# EAGLE design ict_v361 (EAGLE 9.6.2)
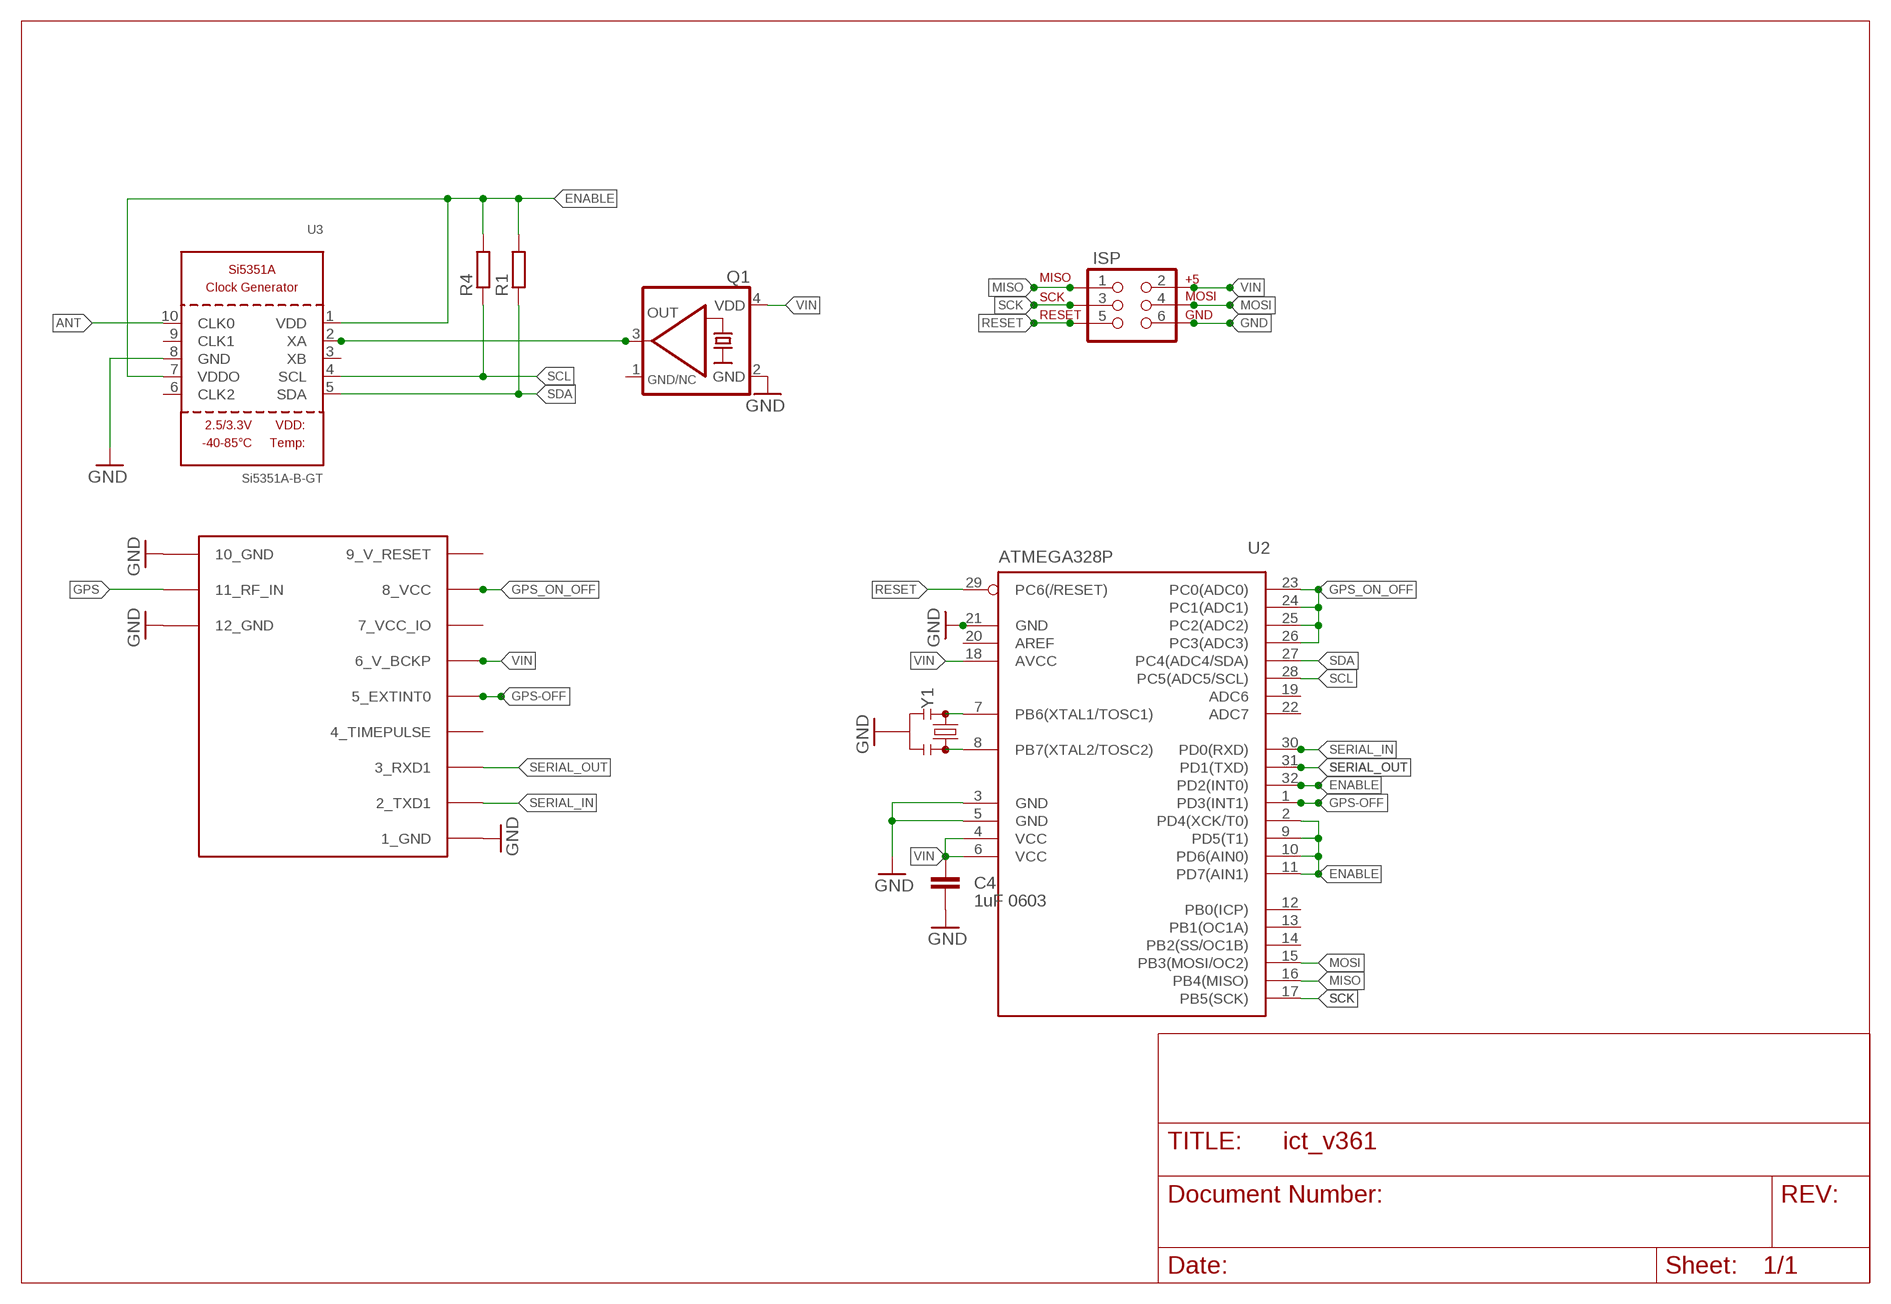
[diagram p0: schematic, sheet 1]

## Parts
C4  1uF 0603  C-EUC0603K  [C0603K]
ISP  AVR_SPI_PRG_6PTH  [2X3]
Q1  KXO-TCXO-CMOS-84  [3.2X2.5_KXO-84-TCXO]
R1  R-EU_R0603  [R0603]
R4  R-EU_R0603  [R0603]
U2  ATMEGA328P  MEGA8-AI  [TQFP32-08]
U3  Si5351A-B-GT  SI5351A  [MSOP10]
U$2  UBLOX_MAX  [UBLOX_MAX]
Y1  RESONATORSMD-4.5X2.0  [RESONATOR-SMD-4.5X2.0]

## Nets
ANT: U3.10(CLK0)
ENABLE: R1.2 R4.2 U2.2(PD4(XCK/T0)) U2.9(PD5(T1)) U2.10(PD6(AIN0)) U2.11(PD7(AIN1)) U2.32(PD2(INT0)) U3.1(VDD) U3.7(VDDO)
GND: C4.2 ISP.6 Q1.2(GND) U2.3(GND) U2.5(GND) U2.21(GND) U3.8(GND) U$2.1_GND U$2.10_GND U$2.12_GND Y1.2
GPS: U$2.11_RF_IN
GPS-OFF: U2.1(PD3(INT1)) U$2.5_EXTINT0
GPS_ON_OFF: U2.23(PC0(ADC0)) U2.24(PC1(ADC1)) U2.25(PC2(ADC2)) U2.26(PC3(ADC3)) U$2.8_VCC
MISO: ISP.1 U2.16(PB4(MISO))
MOSI: ISP.4 U2.15(PB3(MOSI/OC2))
N$1: U2.8(PB7(XTAL2/TOSC2)) Y1.3
N$2: U2.7(PB6(XTAL1/TOSC1)) Y1.1
N$19: Q1.3(OUT) U3.2(XA)
RESET: ISP.5 U2.29(PC6(/RESET))
SCK: ISP.3 U2.17(PB5(SCK))
SCL: R4.1 U2.28(PC5(ADC5/SCL)) U3.4(SCL)
SDA: R1.1 U2.27(PC4(ADC4/SDA)) U3.5(SDA)
SERIAL_IN: U2.30(PD0(RXD)) U$2.2_TXD1
SERIAL_OUT: U2.31(PD1(TXD)) U$2.3_RXD1
VIN: C4.1 ISP.2 Q1.4(VDD) U2.4(VCC) U2.6(VCC) U2.18(AVCC) U$2.6_V_BCKP
Unconnected: U2.12(PB0(ICP)) U2.13(PB1(OC1A)) U2.14(PB2(SS/OC1B)) U2.19(ADC6) U2.20(AREF) U2.22(ADC7) U3.3(XB) U3.6(CLK2) U3.9(CLK1) U$2.4_TIMEPULSE

## Power pins joined to a net without a drawn wire
7_VCC_IO: U$2.7_VCC_IO
9_V_RESET: U$2.9_V_RESET
GND/NC: Q1.1(GND/NC)

## Library data of the parts
C4 = rcl:C-EU: CAPACITOR, European symbol; SPICEPREFIX: C
ISP = SparkFun:AVR_SPI_PRG_6: AVR ISP 6 Pin This is the reduced ISP connector for AVR programming. Common on Arduino. This footprint will take up less PCB space and can be used with a 10-pin to 6-pin adapter such as SKU: BOB-08508
Q1 = crystal-geyer_V1_0:KXO-TCXO-CMOS: TCXO : CMOS - Serie Model Size l/w/h [mm] Frequency Range Frequency Stability Temp. Range [°C] Output AECQ 200 availabel Datasheet KXO-86 KXO-84 KXO-83 KXO-82 2.5/2.0/0.7 3.2/2.5/1.0 5.0/3.2/1.5 7.0/5.0/2.4 13,0 ~ 40,0 MHz 10,0 ~ 40,0 MHz 10,0 ~ 40,0 MHz 10,0 ~ 30,0 MHz ±1,0 … ±2,5ppm ±1,0 … ±2,5ppm ±1,0 … ±3,0ppm ±1,0 … ±3,0ppm (*) -30°C …+75°C (*) -40°C …+85°C (*) -40°C …+85°C (*) -30°C …+80°C CMOS CMOS CMOS CMOS - - - - KXO-86.pdf <http://www.geyer-electronic.de/uploads/tx_userartikelfrequenz/GEYER-KXO-86-TCXO-HCMOS.pdf> KXO-84.pdf <http://www.geyer-electronic.de/uploads/tx_userartikelfrequenz/GEYER-KXO-84-TCXO-HCMOS.pdf> KXO-83.pdf <http://www.geyer-electronic.de/uploads/tx_userartikelfrequenz/GEYER-KXO-83-TCXO-HCMOS.pdf> KXO-82.pdf <http://www.geyer-electronic.de/uploads/tx_userartikelfrequenz/GEYER-KXO-82-TCXO-HCMOS.pdf> <http://www.geyer-electronic.de/fileadmin/template/img/logo-geyer-electronic.png> Details see: http://www.geyer-electronic.de/Frequenz-Produkte.9.0.html Created 2016-06-07, Hans Locher 2016 (C) Geyer Quartz Technology KXO86,KXO84,KXO83,KXO82;2550;3225;5032;7050;2,5x2,0;3,2x2,5;2.5x2.0;3.2x2.5,5,0x3,2;7,0x5,0,5.0x3.2,7.0x5.0
R1 R4 = resistor:R-EU_: RESISTOR, European symbol
U2 = atmel:MEGA8: MICROCONTROLLER 8 Kbytes FLASH, 1 kbytes SRAM, 512 bytes EEPROM, USART, 6-channel 10 bit ADC, 2-channel 8 bit ADC Pin compatible with Atmega48, ATMega88, ATMega168 Source: avr.lbr; MPN: ATMEGA8-16AU; OC_FARNELL: 9171371; OC_NEWARK: 73M8863
U3 = microbuilder:SI5351A: Si5351A 8kHz-160MHz I2C Clock Generator VDD: 2.5V or 3.3V Input Range: 25MHz or 27MHz XTAL User selectable internal input load capacitors: 6, 8 or 10 pF Output Impedance: 85 Ohm Output Load Capacitance: 5-15pF Operating Temperature: -40°C - 85°C Operating Current (3 outputs): 35mA Output buffer voltage (VDDO): 1.8, 2.5 or 3.3V Note: If VDDO is not used it should be connected to VDD. Unused clock out pins should be left floating.
U$2 = Max gps:UBLOX_MAX: UBLOX MAX
Y1 = SparkFun-Clocks:RESONATOR: Resonators (Generic) Ceramic resonators are clock-generating components, often used to control timing in microcontrollers. They usually have 3 pins: two pins for oscillation, and one pin for ground. Compared to crystals, resonators have worse tolerance, but are usually much cheaper. Plus, they have built-in load capacitors! These devices are used on boards like the Arduino Pro 8MHz <https://www.sparkfun.com/products/11114> and Arduino Pro 16MHz <https://www.sparkfun.com/products/11113>.

## Net classes
0 default: width 0.203 mm
1 vcc: width 0.152 mm, clearance 0.152 mm

## Board
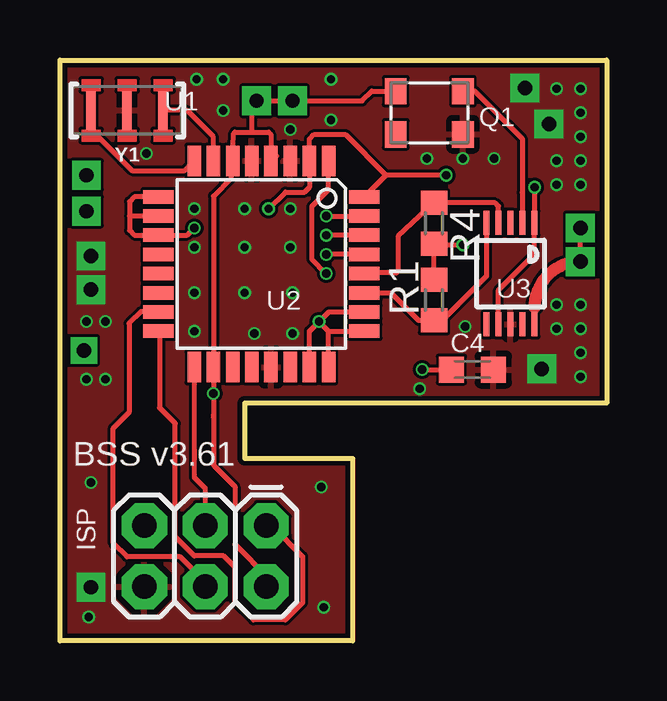
[diagram p1: board, top side]
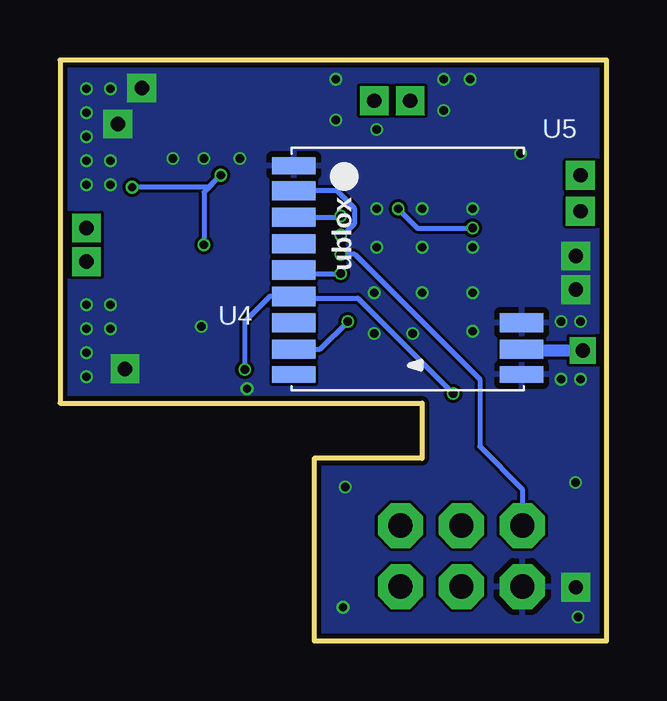
[diagram p2: board, bottom side, seen from below]

Size 22.8 x 24.2 mm. Coordinates in mm from the lower left corner, seen from the top.
Outline: 0,24.2 22.8,24.2 22.8,9.9 7.7,9.9 7.7,7.6 12.2,7.6 12.2,0 0,0 0,24.2
Copper layers (1*16): Top 0.035559375mm / dielectric 1.6mm / Bottom 0.035559375mm
Design rules "jlcpcb2layer *": minimum track width 5mil, minimum drill 12mil, track to track 5mil, track to pad 5mil, pad to pad 5mil, via to via 5mil, smd to smd 5mil, copper to edge 8mil, drill to drill 6mil, minimum pad ring 5mil, minimum via ring 3mil, stop-mask expansion 2.5mil, vias tented up to drill 14mil, thermal gap 10mil

### Footprints (pad centres in the part's own frame; a part is rotated, then mirrored left to right if it is on the bottom)
C0603K = smd 1.05 x 1.08: 1 -0.875,0; 2 0.875,0
2X3 = drill 1.016 pad 1.88 octagon: 1 0,0; 2 0,2.54; 3 2.54,0; 4 2.54,2.54; 5 5.08,0; 6 5.08,2.54
3.2X2.5_KXO-84-TCXO = smd 0.9 x 1.1: 1 -1.4,-0.9; 2 1.4,-0.9; 3 1.4,0.9; 4 -1.4,0.9
R0603 = smd 1 x 1.1: 1 -0.85,0; 2 0.85,0
TQFP32-08 = smd 1.27 x 0.559: 1 -4.293,2.8; 2 -4.293,2; 3 -4.293,1.2; 4 -4.293,0.4; 5 -4.293,-0.4; 6 -4.293,-1.2; 7 -4.293,-2; 8 -4.293,-2.8; 17 4.293,-2.8; 18 4.293,-2; 19 4.293,-1.2; 20 4.293,-0.4; 21 4.293,0.4; 22 4.293,1.2; 23 4.293,2; 24 4.293,2.8 | smd 0.559 x 1.27: 9 -2.8,-4.293; 10 -2,-4.293; 11 -1.2,-4.293; 12 -0.4,-4.293; 13 0.4,-4.293; 14 1.2,-4.293; 15 2,-4.293; 16 2.8,-4.293; 25 2.8,4.293; 26 2,4.293; 27 1.2,4.293; 28 0.4,4.293; 29 -0.4,4.293; 30 -1.2,4.293; 31 -2,4.293; 32 -2.8,4.293
MSOP10 = smd 0.25 x 1: 1 -1,-2.113; 2 -0.5,-2.113; 3 0,-2.113; 4 0.5,-2.113; 5 1,-2.113; 6 1,2.113; 7 0.5,2.113; 8 0,2.113; 9 -0.5,2.113; 10 -1,2.113
UBLOX_MAX = smd 1.8 x 0.7: 1_GND 4.95,-4.4; 9_V_RESET 4.95,4.3; 10_GND -4.55,4.3 | smd 1.8 x 0.8: 2_TXD1 4.95,-3.35; 3_RXD1 4.95,-2.25; 4_TIMEPULSE 4.95,-1.15; 5_EXTINT0 4.95,-0.05; 6_V_BCKP 4.95,1.05; 7_VCC_IO 4.95,2.15; 8_VCC 4.95,3.25; 11_RF_IN -4.55,3.25; 12_GND -4.55,2.15
RESONATOR-SMD-4.5X2.0 = smd 0.4 x 1.6: 1 -1.5,0; 2 0,0; 3 1.5,0

### Placement (x,y rotation side)
C4  17.2,11.3 0 top
ISP  8.6,4.8 180 top
Q1  15.4,22 0 top
R1  15.6,14.2 90 top
R4  15.6,17.4 270 top
U2  8.4,15.7 270 top
U3  18.79,15.3 180 top
U$2  8.1,15.4 180 bottom
Y1  2.8,22.1 180 top

### Tracks (layer width: path | path; a pad name or v marks a point on that pad's centre or on a via)
ANT  (via drill 0.6 pad 1.2)
  Top 0.203: v21.7,17.2 v21.7,15.8 arc90 21.6,15.7 | 19.79,13.89 U3.10
  Top 0.508: v21.7,15.8 arc90 19.79,13.89
ENABLE  (via drill 0.35)
  Top 0.203: U3.7 18.29,14.61 19.79,16.11 U3.1 v19.79,18.9 | R1.2 R4.2 15.65,16.5 v16.8,16.5 | 10.4,20.16 10.5,20.06 10.47,20.06 U2.2 | 13.6,19.4 11.9,21.1 10.6,21.1 10.4,20.9 U2.2 | v16.1,19.4 13.6,19.4 | v5.6,17.2 5.3,16.9 U2.11 3.1,16.9 2.9,17.1 2.9,17.7 | v8.7,18 9.4,18.7 10.2,18.7 10.4,18.9 U2.2 | U2.32 13.59,19.4 13.6,19.4 | 2.9,17.7 2.9,18.3 3.1,18.5 U2.9 | U2.10 2.9,17.7
  Bottom 0.203: v16.8,16.5 16.8,18.7 v16.1,19.4 16.6,18.9 v19.79,18.9 | v8.7,18 7.9,17.2 v5.6,17.2
GND  (via drill 0.35, 0.6 pad 1.2)
  other vias: 7.7,18 1.1,10.9 1.29,16.03 1.29,14.63 1.2,1 9.6,21.3 8.1,12.8 19.39,23.03 20.39,21.53 6.8,23.4 5.7,23.4 16.8,20.1 5.6,18 11.3,23.4 9.6,18 1.1,13.3 5.6,12.9 15.3,20.1 16.9,13.1 1.9,13.3 1.9,10.9 6.8,22.1 15,10.5 3.6,20.3 11.3,21.7 18.1,20.1 20.09,11.33 21.7,11 7.7,16.4 7.7,14.5 5.6,14.5 5.6,16.4 9.6,16.4 21.7,12 21.7,13 21.7,14 20.7,13 20.7,14 21.7,19 20.7,19 21.7,20 20.7,20 21.7,21 21.7,22 21.7,23 20.7,23 1.29,2.23 10.9,6.4 11,1.4 1.3,6.6 9.7,14.5 9.7,12.8
  pour Top: -4.09,27.22 38.75,27.22 38.75,-1.89 -4.19,-1.89 -4.19,27.12
  pour Bottom: -4.19,27.22 38.75,27.22 38.75,-1.89 -4.19,-1.89
GPS  (via drill 0.6 pad 1.1)
  Bottom 0.508: U$2.11_RF_IN 3.5,12.1 v1,12.1
GPS-OFF  (via drill 0.35)
  Top 0.203: v11.1,15.3 10.5,15.9 10.5,18.1 11.2,18.8 U2.1
  Bottom 0.203: U$2.5_EXTINT0 13,15.3 v11.1,15.3
GPS_ON_OFF  (via drill 0.35)
  Top 0.203: U2.24 11.2,12.9 | 11.2,12.9 U2.25 | v10.8,13.3 11.2,12.9 | U2.23 10.4,12.9 v10.8,13.3 | U2.26 11.2,13.7 v10.8,13.3
  Bottom 0.203: U$2.8_VCC 11.95,12.15 v10.8,13.3
MISO
  Top 0.203: U2.16 4.15,12.86 4.15,9.71 4.8,9.06 4.8,4.33 5.59,3.54 6.82,3.54 7.3,3.06 7.3,1.64 8.07,0.87 9.4,0.87 10.12,1.59 10.12,3.51 8.84,4.79 | 8.84,4.79 8.8,4.79 | ISP.1 8.83,4.8 8.84,4.79
MOSI
  Top 0.203: U2.15 3.96,13.72 3.38,13.72 2.88,13.23 2.88,9.52 2.23,8.86 2.23,4.07 2.8,3.5 5.01,3.5 6.25,2.26 | 6.26,2.26 6.25,2.26 | ISP.4 6.25,2.26
N$1
  Top 0.203: Y1.3 1.3,21.3 3.01,19.59 5.2,19.59 U2.8
N$2
  Top 0.203: U2.7 6.4,21 5.3,22.1 Y1.1
N$7  (via drill 0.6 pad 1.2)
  other vias: 1.1,19.4
N$8  (via drill 0.6 pad 1.2)
  other vias: 1.1,17.9
N$19
  Top 0.203: U3.2 19.29,18.67 19.27,18.69 19.27,20.93 17.3,22.9 Q1.3
RESET  (via drill 0.35)
  Top 0.203: U2.29 v11.1,16.1
  Bottom 0.203: v11.1,16.1 10.5,16.1 5.3,10.9 5.3,8.1 3.52,6.32 ISP.5
SCK
  Top 0.203: ISP.3 6.06,6.36 5.6,6.82 U2.17
SCL
  Top 0.203: U2.28 12.83,15.33 14.03,15.33 14.1,15.4 14.1,16.85 R4.1 18.15,18.25 18.29,18.11 U3.4
SDA
  Top 0.203: U3.5 17.79,15.19 15.95,13.35 R1.1 14.95,13.35 13.8,14.5 U2.27
SERIAL_IN  (via drill 0.35)
  Top 0.203: U2.30 v11.1,16.9
  Bottom 0.203: v11.1,16.9 11,16.9 10.5,17.4 10.5,18 11.25,18.75 U$2.2_TXD1
SERIAL_OUT  (via drill 0.35)
  Top 0.203: v11.1,17.7 U2.31
  Bottom 0.203: U$2.3_RXD1 11.25,17.65 v11.1,17.7
VIN  (via drill 0.35, 0.6 pad 1.2)
  Top 0.203: 9.03,20.19 U2.4 8.8,21.1 8.7,21.2 8,21.2 | 6.4,11.46 U2.18 | U2.18 6.4,18.53 7.15,19.27 7.15,19.96 U2.6 7.24,21.14 7.3,21.2 8,21.2 | 8,21.2 8,22.3 v8.2,22.5 v9.7,22.5 12.6,22.5 13,22.9 Q1.4 | v15.1,11.3 C4.1 | 8.78,2.26 8.7,2.34 8.7,2.61 7.3,4.01 7.3,6.42 6.4,7.32 6.4,9.3 6.4,9.41 v6.4,10.3 U2.18 | ISP.2 8.78,2.26 | 8.78,2.26 8.79,2.25
  Bottom 0.203: v6.4,10.3 10.38,14.28 12.98,14.28 U$2.6_V_BCKP 14.05,14.35 15.1,13.3 v15.1,11.3

### Text on the board
tNames: U1 | BSS v3.61
bNames: U5 | U4